# EAGLE design MainBoardR1 (EAGLE 6.4)
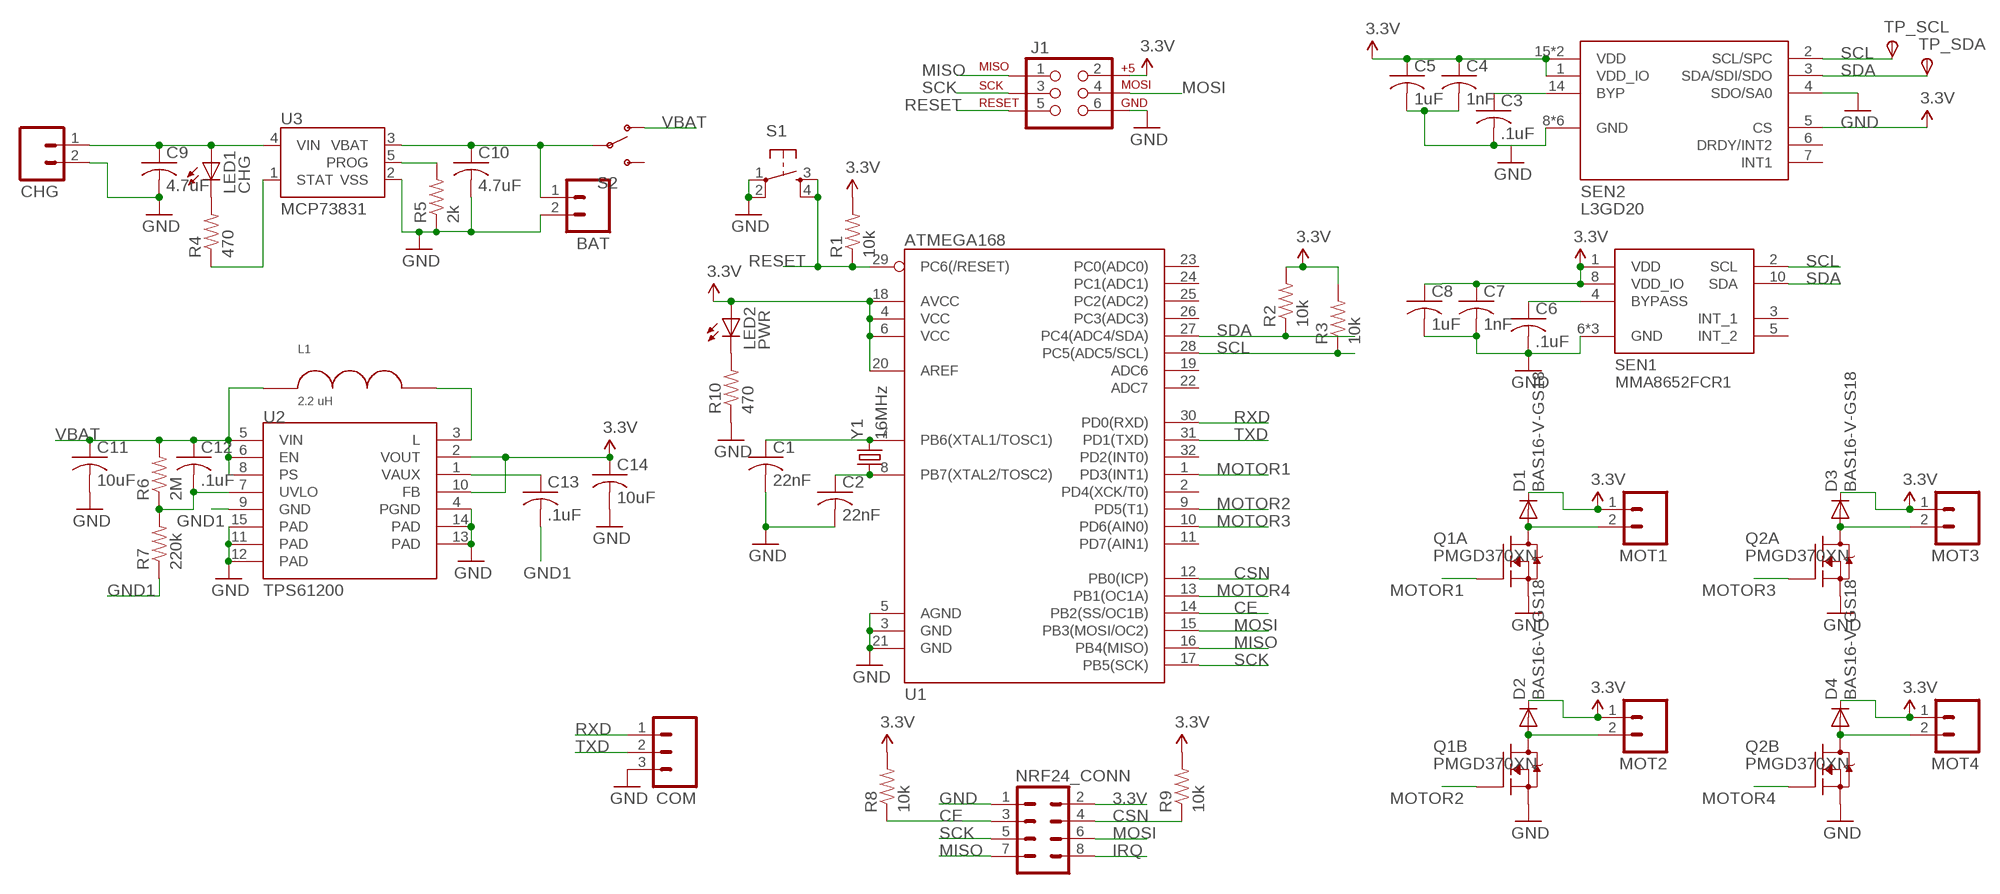
[diagram p0: schematic, sheet 1]

## Parts
BAT  M02LOCK_LONGPADS  [1X02_LOCK_LONGPADS]
C1  22nF  C-USC0805  [C0805]
C2  22nF  C-USC0805  [C0805]
C3  .1uF  C-USC0805  [C0805]
C4  1nF  C-USC0805  [C0805]
C5  1uF  C-USC0805  [C0805]
C6  .1uF  C-USC0805  [C0805]
C7  1nF  C-USC0805  [C0805]
C8  1uF  C-USC0805  [C0805]
C9  4.7uF  C-USC0805  [C0805]
C10  4.7uF  C-USC0805  [C0805]
C11  10uF  C-USC0805  [C0805]
C12  .1uF  C-USC0805  [C0805]
C13  .1uF  C-USC0805  [C0805]
C14  10uF  C-USC0805  [C0805]
CHG  M02LOCK_LONGPADS  [1X02_LOCK_LONGPADS]
COM  M03LONGPADS  [1X03_LONGPADS]
D1  BAS16-V-GS18  [SOT23]
D2  BAS16-V-GS18  [SOT23]
D3  BAS16-V-GS18  [SOT23]
D4  BAS16-V-GS18  [SOT23]
J1  AVR_SPI_PRG_62X3_LOCK  [2X3_LOCK]
L1  2.2 uH  BRHL2518T2R2M  [2518]
LED1  CHG  LED1206  [LED-1206]
LED2  PWR  LED1206  [LED-1206]
MOT1  M02LOCK_LONGPADS  [1X02_LOCK_LONGPADS]
MOT2  M02LOCK_LONGPADS  [1X02_LOCK_LONGPADS]
MOT3  M02LOCK_LONGPADS  [1X02_LOCK_LONGPADS]
MOT4  M02LOCK_LONGPADS  [1X02_LOCK_LONGPADS]
NRF24_CONN  M04X2  [2X4]
Q1  PMGD370XN  [SOT363_INFINEON]
Q2  PMGD370XN  [SOT363_INFINEON]
R1  10k  RESISTOR0805-RES  [0805]
R2  10k  RESISTOR0805-RES  [0805]
R3  10k  RESISTOR0805-RES  [0805]
R4  470  RESISTOR0805-RES  [0805]
R5  2k  RESISTOR0805-RES  [0805]
R6  2M  RESISTOR0805-RES  [0805]
R7  220k  RESISTOR0805-RES  [0805]
R8  10k  RESISTOR0805-RES  [0805]
R9  10k  RESISTOR0805-RES  [0805]
R10  470  RESISTOR0805-RES  [0805]
S1  TAC_SWITCHSMD  [TACTILE_SWITCH_SMD]
S2  SWITCH-SPST-SMD-A  [SWITCH-SPST-SMD-A]
SEN1  MMA8652FCR1  [10_PIN_DFN]
SEN2  L3GD20  [LGA-16]
TP_SCL  TPSTP14SQ  [TP14SQ]
TP_SDA  TPSTP14SQ  [TP14SQ]
U1  ATMEGA168  [TQFP32-08]
U2  TPS61200  [QFN-10_PAD]
U3  MCP73831  [SOT23-5]
Y1  16MHz  CRYSTAL5X3  [CRYSTAL-SMD-5X3]

## Nets
3.3V: C4.1 C5.1 C7.1 C8.1 C14.1 D1.3(C) D2.3(C) D3.3(C) D4.3(C) J1.2 LED2.A MOT1.1 MOT2.1 MOT3.1 MOT4.1 NRF24_CONN.2 R1.2 R2.2 R3.2 R8.2 R9.2 SEN1.1(VDD) SEN1.8(VDD_IO) SEN2.1(VDD_IO) SEN2.5(CS) SEN2.15(VDD) SEN2.16(VDD) U1.4(VCC) U1.6(VCC) U1.18(AVCC) U1.20(AREF) U2.2(VOUT) U2.10(FB)
CE: NRF24_CONN.3 R8.1 U1.14(PB2(SS/OC1B))
CSN: NRF24_CONN.4 R9.1 U1.12(PB0(ICP))
GND: BAT.2 C1.2 C2.2 C3.2 C4.2 C5.2 C6.2 C7.2 C8.2 C9.2 C10.2 C11.2 C14.2 CHG.2 COM.3 J1.6 NRF24_CONN.1 Q1.1(A:S) Q1.4(B:S) Q2.1(A:S) Q2.4(B:S) R5.1 R10.1 S1.1 S1.2 SEN1.6(GND) SEN1.7(GND) SEN1.9(GND) SEN2.4(SDO/SA0) SEN2.8(GND) SEN2.9(GND) SEN2.10(GND) SEN2.11(GND) SEN2.12(GND) SEN2.13(GND) U1.3(GND) U1.5(AGND) U1.21(GND) U2.4(PGND) U2.11(PAD) U2.12(PAD) U2.13(PAD) U2.14(PAD) U2.15(PAD) U3.2(VSS)
GND1: C13.2 R7.1 U2.9(GND)
IRQ: NRF24_CONN.8
MISO: J1.1 NRF24_CONN.7 U1.16(PB4(MISO))
MOSI: J1.4 NRF24_CONN.6 U1.15(PB3(MOSI/OC2))
MOT3: D3.1(A) MOT3.2 Q2.6(A:D)
MOTOR1: Q1.2(A:G) U1.1(PD3(INT1))
MOTOR2: Q1.5(B:G) U1.9(PD5(T1))
MOTOR3: Q2.2(A:G) U1.10(PD6(AIN0))
MOTOR4: Q2.5(B:G) U1.13(PB1(OC1A))
N$1: C3.1 SEN2.14(BYP)
N$2: C1.1 U1.7(PB6(XTAL1/TOSC1)) Y1.3
N$3: C2.1 U1.8(PB7(XTAL2/TOSC2)) Y1.1
N$4: D1.1(A) MOT1.2 Q1.6(A:D)
N$5: LED1.C R4.2
N$6: C6.1 SEN1.4(BYPASS)
N$7: D4.1(A) MOT4.2 Q2.3(B:D)
N$8: D2.1(A) MOT2.2 Q1.3(B:D)
N$9: C9.1 CHG.1 LED1.A U3.4(VIN)
N$10: R4.1 U3.1(STAT)
N$11: BAT.1 C10.1 S2.2(P) U3.3(VBAT)
N$12: R5.2 U3.5(PROG)
N$13: C13.1 U2.1(VAUX)
N$14: C12.2 R6.1 R7.2 U2.7(UVLO)
N$15: LED2.C R10.2
N$16: L1.P$2 U2.3(L)
RESET: J1.5 R1.1 S1.3 S1.4 U1.29(PC6(/RESET))
RXD: COM.1 U1.30(PD0(RXD))
SCK: J1.3 NRF24_CONN.5 U1.17(PB5(SCK))
SCL: R3.1 SEN1.2(SCL) SEN2.2(SCL/SPC) TP_SCL.TP(PP) U1.28(PC5(ADC5/SCL))
SDA: R2.1 SEN1.10(SDA) SEN2.3(SDA/SDI/SDO) TP_SDA.TP(PP) U1.27(PC4(ADC4/SDA))
TXD: COM.2 U1.31(PD1(TXD))
VBAT: C11.1 C12.1 L1.P$1 R6.2 S2.1(O) U2.5(VIN) U2.6(EN) U2.8(PS)
Unconnected: S2.3(S) SEN1.3(INT_1) SEN1.5(INT_2) SEN2.6(DRDY/INT2) SEN2.7(INT1) U1.2(PD4(XCK/T0)) U1.11(PD7(AIN1)) U1.19(ADC6) U1.22(ADC7) U1.23(PC0(ADC0)) U1.24(PC1(ADC1)) U1.25(PC2(ADC2)) U1.26(PC3(ADC3)) U1.32(PD2(INT0))

## Library data of the parts
BAT CHG MOT1-MOT4 = SparkFun:M02: Header 2 Standard 2-pin 0.1" header. Use with straight break away headers (SKU : PRT-00116), right angle break away headers (PRT-00553), swiss pins (PRT-00743), machine pins (PRT-00117), and female headers (PRT-00115). Molex polarized connector foot print use with SKU : PRT-08233 with associated crimp pins and housings.
C1-C14 = rcl:C-US: CAPACITOR, American symbol
COM = SparkFun:M03: Header 3 Standard 3-pin 0.1" header. Use with straight break away headers (SKU : PRT-00116), right angle break away headers (PRT-00553), swiss pins (PRT-00743), machine pins (PRT-00117), and female headers (PRT-00115). Molex polarized connector foot print use with SKU : PRT-08232 with associated crimp pins and housings.
D1-D4 = diode:BAS16-V-GS18
J1 = SparkFun:AVR_SPI_PRG_6: AVR ISP 6 Pin This is the reduced ISP connector for AVR programming. Common on Arduino. This footprint will take up less PCB space and can be used with a 10-pin to 6-pin adapter such as SKU: BOB-08508
L1 = inductors:BRHL2518T2R2M
LED1 LED2 = SparkFun:LED: LEDs Standard schematic elements and footprints for 5mm, 3mm, 1206, and 0603 sized LEDs. 5mm - Spark Fun Electronics SKU : COM-00529 (and others)
NRF24_CONN = SparkFun:M04X2
Q1 Q2 = transistor-fet:PMGD370XN: N-Channel Power MOSFET
R1-R10 = SparkFun:RESISTOR: Resistor Basic schematic elements and footprints for 0603, 1206, and PTH resistors.
S1 = SparkFun:TAC_SWITCH: Momentary Switch Button commonly used for reset or general input. Spark Fun Electronics SKU : COM-00097
S2 = SparkFun:SWITCH-SPST: SPST Switch Simple slide switch. Spark Fun Electronics SKU : COM-00102
SEN1 = Sensors:MMA8652FCR1
SEN2 = Sensors:L3GD20
TP_SCL TP_SDA = testpad:TPS: TEST PIN
U1 = SparkFun:ATMEGA168
U2 = SparkFun:TPS61200: DC to DC Booster
U3 = SparkFun:MCP73831: Microchip's MCP73831 Miniature single cell, fully integrated Li-Ion, Li-polymer charge management controller http://ww1.microchip.com/downloads/en/DeviceDoc/21984a.pdf
Y1 = SparkFun:CRYSTAL: Crystals Various standard crystals. Proven footprints. Spark Fun Electronics SKU : COM-00534

## Board
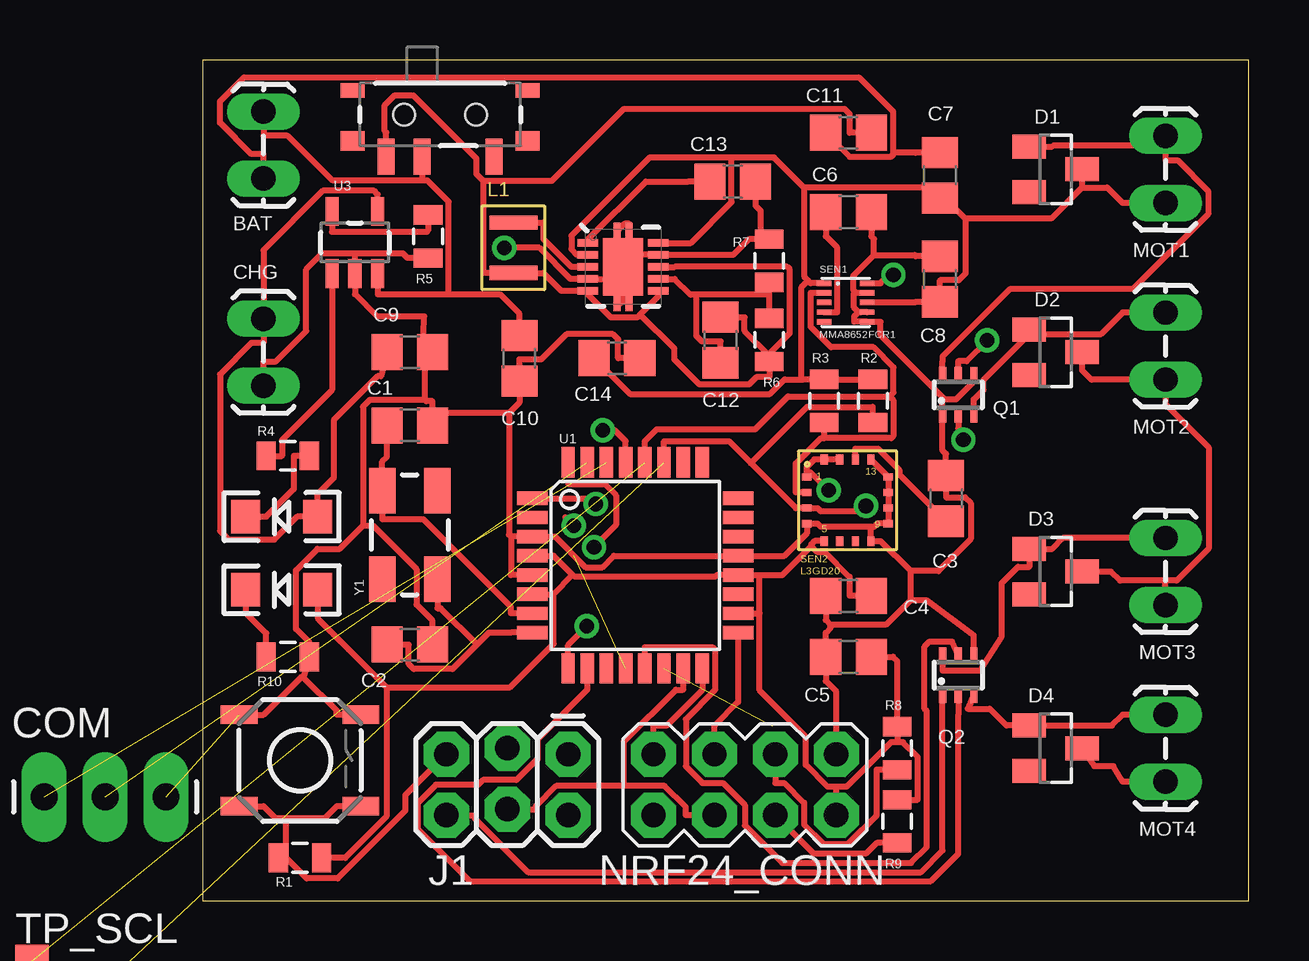
[diagram p1: board, top side]
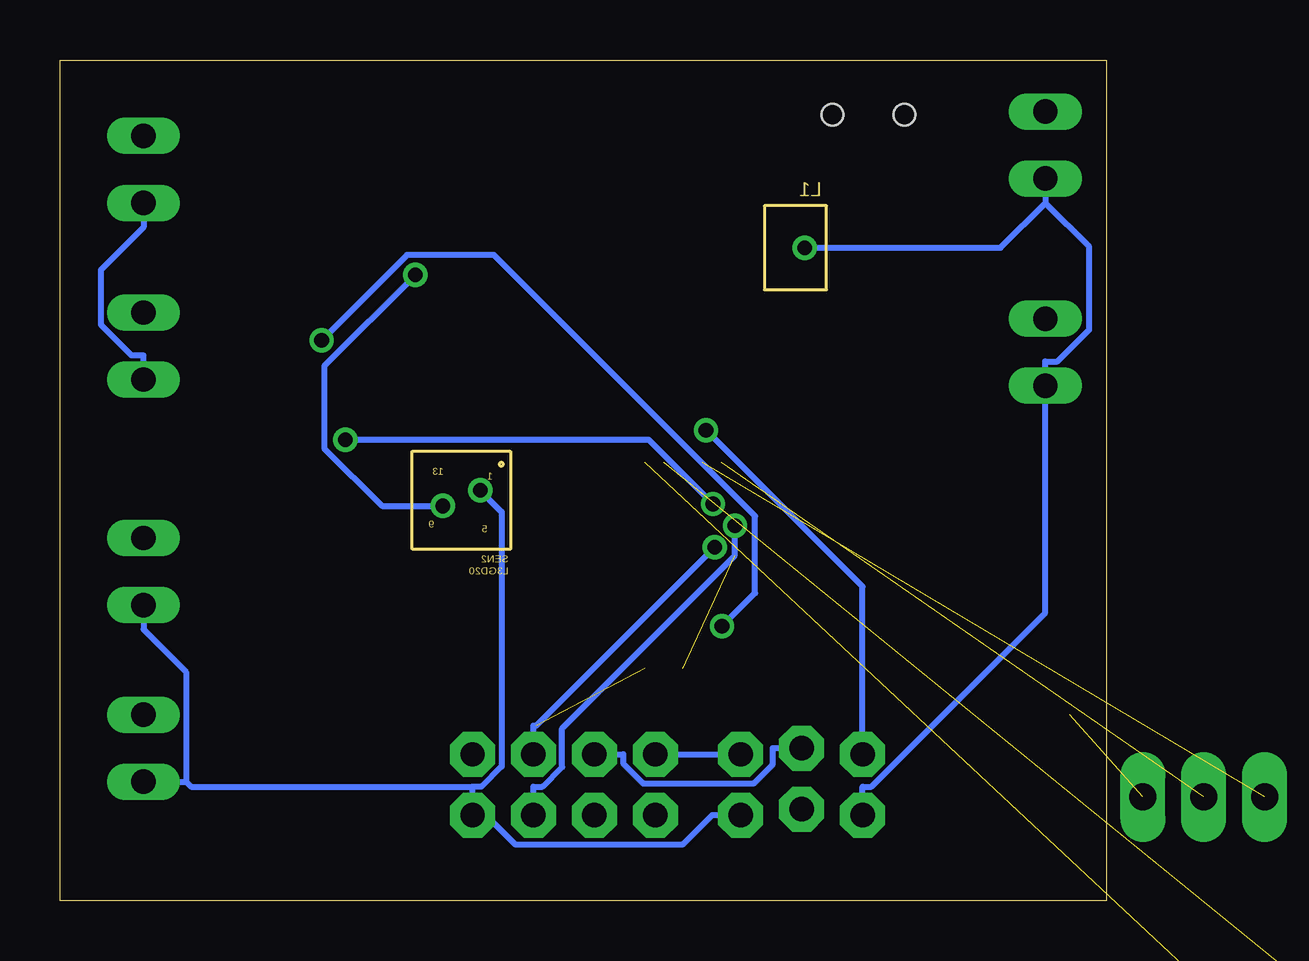
[diagram p2: board, bottom side, seen from below]

Size 43.61 x 35.04 mm. Coordinates in mm from the lower left corner, seen from the top.
Outline: 0,0 43.61,0 43.61,35.04 0,35.04 0,0
Copper layers (1*16): Top 0.035mm / dielectric 1.5mm / Bottom 0.035mm
Design rules "default *": minimum track width 10mil, minimum drill 24mil, track to track 5mil, track to pad 5mil, pad to pad 8mil, via to via 8mil, smd to smd 8mil, copper to edge 40mil, drill to drill 8mil, minimum pad ring 10mil, minimum via ring 8mil, stop-mask expansion 4mil, vias tented up to drill 0mil, thermal gap 10mil

### Footprints (pad centres in the part's own frame; a part is rotated, then mirrored left to right if it is on the bottom)
1X02_LOCK_LONGPADS = drill 1.016 long: 1 -0.127,0; 2 2.667,0
C0805 = smd 1.3 x 1.5: 1 -0.95,0; 2 0.95,0
1X03_LONGPADS = drill 1.118 pad 1.88 long: 1 0,0; 2 2.54,0; 3 5.08,0
SOT23 = smd 1 x 1.4: 1 -0.95,-1.1; 2 0.95,-1.1; 3 0,1.1
2X3_LOCK = drill 1.016 pad 1.88 octagon: 1 0,0; 2 0,2.54; 3 2.54,-0.254; 4 2.54,2.286; 5 5.08,0; 6 5.08,2.54
2518 = smd 0.6 x 2: P$1 0,0; P$2 2.1,0
LED-1206 = smd 1.2 x 1.4: A -1.5,0; C 1.5,0
2X4 = drill 1.016 pad 1.88 octagon: 1 -3.81,-1.27; 2 -3.81,1.27; 3 -1.27,-1.27; 4 -1.27,1.27; 5 1.27,-1.27; 6 1.27,1.27; 7 3.81,-1.27; 8 3.81,1.27
SOT363_INFINEON = smd 0.3 x 0.7: 1 -0.65,-0.8; 2 0,-0.8; 3 0.65,-0.8; 4 0.65,0.8; 5 0,0.8; 6 -0.65,0.8
0805 = smd 0.8 x 1.2: 1 -0.9,0; 2 0.9,0
TACTILE_SWITCH_SMD = smd 1.524 x 0.762: 1 -2.54,1.905; 2 2.54,1.905; 3 -2.54,-1.905; 4 2.54,-1.905
SWITCH-SPST-SMD-A = smd 0.7 x 1.5: 1 -2.25,-1.75; 2 -0.75,-1.75; 3 2.25,-1.75 | smd 1 x 0.6: GND1 -3.65,1; GND3 3.65,1 | smd 1 x 0.8: GND2 -3.65,-1.1; GND4 3.65,-1.1 | hole 0.9: -1.5,0; 1.5,0
10_PIN_DFN = smd 0.6 x 0.225: 1 0,1.6; 2 0,1.2; 3 0,0.8; 4 0,0.4; 5 0,0; 6 1.8,0; 7 1.8,0.4; 8 1.8,0.8; 9 1.8,1.2; 10 1.8,1.6
LGA-16 = smd 0.4 x 0.3: 1 -0.725,2.675; 2 -0.725,2.025; 3 -0.725,1.375; 4 -0.725,0.725; 9 2.675,0.725; 10 2.675,1.375; 11 2.675,2.025; 12 2.675,2.675 | smd 0.3 x 0.4: 5 0,0; 6 0.65,0; 7 1.3,0; 8 1.95,0; 13 1.95,3.4; 14 1.3,3.4; 15 0.65,3.4; 16 0,3.4
TP14SQ = smd 1.4 x 1.4: TP 0,0
TQFP32-08 = smd 1.27 x 0.559: 1 -4.293,2.8; 2 -4.293,2; 3 -4.293,1.2; 4 -4.293,0.4; 5 -4.293,-0.4; 6 -4.293,-1.2; 7 -4.293,-2; 8 -4.293,-2.8; 17 4.293,-2.8; 18 4.293,-2; 19 4.293,-1.2; 20 4.293,-0.4; 21 4.293,0.4; 22 4.293,1.2; 23 4.293,2; 24 4.293,2.8 | smd 0.559 x 1.27: 9 -2.8,-4.293; 10 -2,-4.293; 11 -1.2,-4.293; 12 -0.4,-4.293; 13 0.4,-4.293; 14 1.2,-4.293; 15 2,-4.293; 16 2.8,-4.293; 25 2.8,4.293; 26 2,4.293; 27 1.2,4.293; 28 0.4,4.293; 29 -0.4,4.293; 30 -1.2,4.293; 31 -2,4.293; 32 -2.8,4.293
QFN-10_PAD = smd 0.297 x 0.85: 1 -1,-1.475; 2 -0.5,-1.475; 3 0,-1.475; 4 0.5,-1.475; 5 1,-1.475; 6 1,1.475; 7 0.5,1.475; 8 0,1.475; 9 -0.5,1.475; 10 -1,1.475 | smd 0.7 x 0.28: 11 -1.5,0.25; 12 -1.5,-0.25; 13 1.5,0.25; 14 1.5,-0.25 | smd 2.4 x 1.65: 15 0,0
SOT23-5 = smd 0.55 x 1.2: 1 -0.95,-1.3; 2 0,-1.3; 3 0.95,-1.3; 4 0.95,1.3; 5 -0.95,1.3
CRYSTAL-SMD-5X3 = smd 1.9 x 1.1: 1 -1.85,-1.15; 2 1.85,-1.15; 3 1.85,1.15; 4 -1.85,1.15

### Placement (x,y rotation side)
BAT  2.54,32.77 270 top
C1  8.64,19.81 0 top
C2  8.64,10.67 0 top
C3  30.99,16.76 90 top
C4  26.92,12.7 180 top
C5  26.92,10.16 180 top
C6  26.92,28.7 0 top
C7  30.73,30.23 90 top
C8  30.73,25.91 90 top
C9  8.64,22.86 0 top
C10  13.21,22.61 270 top
C11  26.92,32 180 top
C12  21.59,23.37 270 top
C13  22.1,29.97 0 top
C14  17.27,22.61 0 top
CHG  2.54,24.13 270 top
COM  -6.6,4.32 0 top
D1  35.56,30.48 270 top
D2  35.56,22.86 270 top
D3  35.56,13.72 270 top
D4  35.56,6.35 270 top
J1  15.24,6.1 180 top
L1  12.95,26.16 90 top
LED1  3.3,16 180 top
LED2  3.3,12.95 180 top
MOT1  40.13,29.21 90 top
MOT2  40.13,21.84 90 top
MOT3  40.13,12.45 90 top
MOT4  40.13,5.08 90 top
NRF24_CONN  22.61,4.83 180 top
Q1  31.5,21.08 0 top
Q2  31.5,9.4 0 top
R1  4.06,1.78 0 top
R2  27.94,20.83 90 top
R3  25.91,20.83 90 top
R4  3.56,18.54 0 top
R5  9.4,27.69 90 top
R6  23.62,23.37 270 top
R7  23.62,26.67 270 top
R8  28.96,6.35 90 top
R9  28.96,3.3 90 top
R10  3.56,10.16 180 top
S1  4.06,5.84 0 top
S2  9.91,32.77 0 top
SEN1  25.91,24.13 0 top
SEN2  25.91,14.99 0 top
TP_SCL  -7.11,-2.54 0 top  (outside the outline)
TP_SDA  -7.11,-6.35 0 top  (outside the outline)
U1  18.03,13.97 0 top
U2  17.53,26.42 270 top
U3  6.35,27.43 0 top
Y1  8.64,15.24 90 top

### Tracks (layer width: path | path; a pad name or v marks a point on that pad's centre or on a via)
3.3V  (via drill 0.61 pad 1.02)
  Top 0.254: 31.8,28.44 31.8,26.14 31.52,25.86 30.73,25.86 C8.1 29.73,24.96 29.7,24.93 SEN1.8 | 30.73,29.5 31.8,28.44 | 36.66,29.73 35.37,28.44 31.8,28.44 | 36.66,29.73 36.66,29.91 D1.3 | 30.73,29.5 30.73,29.73 25.07,29.73 | C7.1 30.73,29.5 | 15.43,13.57 15.49,13.52 21.38,13.52 21.44,13.57 U1.20 23.12,13.57 23.22,13.57 | D4.3 37.17,5.6 37.97,5.6 38.35,4.95 MOT4.1 | R2.2 R3.2 25.48,21.73 25.05,21.73 24.96,21.73 | C14.1 17.81,21.12 23.65,21.12 24.26,21.73 24.96,21.73 | 24.96,21.73 24.96,25.58 25.23,25.85 | 25.37,14.77 25.61,14.53 25.93,14.53 26.97,13.5 26.97,12.7 C4.1 | 25.37,14.77 25.37,14.85 25.5,14.99 SEN2.5 | 23.22,13.57 24.17,13.57 25.37,14.77 | 23.22,11.97 23.22,13.57 | 26.42,4.75 26.05,4.75 25.15,5.65 25.15,6.83 23.22,8.76 23.22,11.97 | 25.23,25.85 25.35,25.73 SEN1.1 | 25.07,29.73 25.07,26.01 25.23,25.85 | 25.07,29.73 | 25.07,29.73 23.82,30.98 22.05,30.98 | 15.43,13.57 14.63,12.77 | 15.43,13.57 14.63,14.37 U1.4 | 7.67,8.89 12.82,8.89 14.63,10.71 14.63,12.77 | LED2.A 4.8,11.76 7.67,8.89 | 7.67,8.89 7.67,3.5 5.95,1.78 R1.2 | MOT1.1 38.35,29.08 37.71,29.73 36.66,29.73 | SEN2.15 SEN2.16 25.5,18.39 25.18,18.07 25.18,17.86 | U1.6 14.63,12.77 | 22.05,30.98 18.63,30.98 15.37,27.72 15.37,27.16 15.62,26.92 U2.2 | U1.18 23.22,11.97 | NRF24_CONN.2 26.42,4.75 | 28.96,6.6 28.69,6.6 26.85,4.75 26.42,4.75 | 28.96,6.6 29.2,6.6 29.81,5.99 29.81,4.2 R9.2 | U2.10 20.35,27.42 22.05,29.12 22.05,30.98 | 40.13,13.34 40.6,13.34 41.94,14.67 41.94,18.89 40.13,20.7 MOT2.1 37.05,21.72 36.66,22.11 D2.3 | 28.96,6.6 R8.2 28.96,7.9 28.96,9.98 28.78,10.16 C5.1 | MOT3.1 40.13,12.83 40.13,13.34 | D3.3 37.87,13.72 38.25,13.34 40.13,13.34
  Top 0.254: 25.18,17.86 25.33,17.86 v26.1,17.1 | SEN2.1 25.18,17.86
  Bottom 0.254: MOT2.1 40.13,22.73 40.64,22.73 41.91,24 41.91,26.29 40.13,28.07 MOT1.1 | MOT3.1 40.13,11.3 38.35,9.53 38.35,4.95 | J1.2 16.43,3.56 17.65,2.34 24.64,2.34 26.42,4.12 | 26.42,4.12 26.42,4.75 | NRF24_CONN.2 26.42,4.12 | MOT4.1 38.35,4.95 | 38.35,4.95 38.15,4.75 26.42,4.75 | v26.1,17.1 25.2,16.21 25.2,5.59 26.05,4.75 26.42,4.75
CE  (via drill 0.61 pad 1.02)  (1 unrouted)
  Top 0.254: 15.23,17.37 16.76,17.37 17.23,16.91 17.23,15.65 v16.32,14.73 | R8.1 28.1,5.45 28.1,3.55 26.91,2.36 25.87,2.36 25.07,3.16 25.07,4.08 24.25,4.9 23.88,4.9 NRF24_CONN.3
  Bottom 0.254: v16.32,14.73 23.76,7.29 23.88,7.29 NRF24_CONN.3
CSN  (via drill 0.61 pad 1.02)  (1 unrouted)
  Top 0.254: 15.12,15.97 v15.48,15.62 | R9.1 28.1,2.4 27.68,1.98 25.46,1.98 NRF24_CONN.4
  Bottom 0.254: v15.48,15.62 15.48,14.39 22.68,7.18 22.68,5.57 23.5,4.75 23.88,4.75 NRF24_CONN.4
GND  (via drill 0.61 pad 1.02)  (1 unrouted)
  Top 0.254: 12.85,15.17 12.85,13.57 U1.5 | 12.77,20.31 12.77,15.25 12.85,15.17 | 12.77,20.31 9.59,20.31 | 12.77,20.31 13.21,20.75 C10.2 13.21,22.56 14.11,22.56 15.16,23.61 17.11,23.61 17.32,23.4 17.32,22.61 C14.2 | 12.85,15.17 U1.3 14.7,15.17 15.97,13.9 16.66,13.9 17.14,14.37 U1.21 24.25,14.37 25.18,15.31 SEN2.4 25.64,15.71 25.77,15.58 27.86,15.58 | 27.86,15.58 27.99,15.58 28.13,15.71 SEN2.9 SEN2.10 SEN2.11 SEN2.12 SEN2.13 | 27.86,15.58 27.86,15.44 SEN2.8 28.26,14.99 29.52,13.73 | 6.68,15.63 7.1,15.63 8.92,13.82 8.92,12.34 9.59,11.67 C2.2 | 9.27,20.88 6.97,20.88 6.68,20.59 6.68,15.63 | 6.68,15.63 5.72,14.67 4.79,14.67 3.89,13.77 3.89,11.32 4.46,10.76 R10.1 4.2,9.31 | 9.27,20.88 9.27,22.86 | 9.27,20.88 9.33,20.82 9.59,20.82 9.59,20.31 | C1.2 9.59,20.31 | BAT.2 2.54,31.11 2.03,31.11 0.73,32.42 0.73,33.32 1.73,34.32 27.36,34.32 28.78,32.9 28.78,31.18 | 28.78,31.18 28.78,31.09 28.69,31 26.98,31 C11.2 | 28.78,31.18 29.73,31.18 C7.2 | C8.2 29.73,26.86 29.67,26.92 27.99,26.92 | 30.95,20.89 28.26,23.58 28.26,24.13 SEN1.6 27.15,24.13 27.15,24.35 27.34,24.53 | Q1.4 32.15,21.63 31.4,20.89 30.95,20.89 | 30.95,20.89 30.85,20.89 Q1.1 30.85,18.76 30.99,18.62 C3.2 30.99,16.81 31.78,16.81 32.02,16.57 32.02,15.08 30.67,13.73 29.52,13.73 | 30.95,20.89 | Q2.1 30.85,2.09 29.95,1.19 13.57,1.19 11.35,3.41 11.35,3.56 J1.6 | 29.52,12.53 28.48,11.49 26.18,11.49 | Q2.4 32.15,11.06 30.17,12.53 29.52,12.53 | 17.53,25 17.69,25 U2.13 | U2.14 17.44,24.92 17.53,25 | 17.53,25 17.53,25.08 17.53,25.95 | 9.27,22.86 9.2,22.86 9.24,24.35 7.28,24.35 6.35,25.28 U3.2 6.35,26.99 | C9.2 9.27,22.86 | 29.52,12.53 29.52,13.73
  Top 0.254: 26.18,11.49 25.97,11.7 C4.2 | 26.18,11.49 26.18,11.37 25.97,11.16 C5.2 25.97,9.16 26.42,8.71 NRF24_CONN.1 | 27.99,26.92 27.99,27.58 27.87,27.7 C6.2 | 27.25,25.33 27.12,25.45 27.12,26.05 27.99,26.92 | 27.25,25.33 27.15,25.33 27.15,24.71 27.34,24.53 | 27.25,25.33 27.34,25.33 27.43,25.33 SEN1.9 | 27.34,24.53 27.43,24.53 SEN1.7 | v12.57,27.21 14.04,27.21 15.33,25.92 U2.4 16.3,25.92 16.73,25.92 16.76,25.95 17.53,25.95 | CHG.2 2.54,22.48 3.05,22.48 4.32,23.75 4.32,26.32 4.98,26.99 6.35,26.99 | R5.1 8.54,26.79 8.34,26.99 6.35,26.99 | 17.53,25.95 U2.15 17.53,27.06 17.28,27.31 U2.12 17.58,28.22 17.78,28.22 U2.11 | S1.2 5.59,7.75 5.59,7.92 4.2,9.31 | S1.1 2.54,7.75 4.1,9.31 4.2,9.31
  Bottom 0.254: v12.57,27.21 4.41,27.21 2.54,29.08 | J1.6 10.16,4.75 9.79,4.75 2.54,12 CHG.2 2.54,22.48 2.03,22.48 0.72,23.8 0.72,27.26 2.54,29.08 | BAT.2 2.54,29.08
GND1
  Top 0.254: C13.2 23.05,28.97 23.26,28.76 23.26,27.57 | 23.26,27.57 22.77,27.57 22.11,26.92 U2.9 | R7.1 23.26,27.57
MISO
  Top 0.254: NRF24_CONN.7 18.8,7.29 19.34,7.29 20.83,8.79 U1.16
  Bottom 0.254: NRF24_CONN.7 J1.1
MOSI
  Top 0.254: 17.57,4.78 14.74,4.78 13.89,3.93 13.89,3.81 J1.4 | 17.57,4.78 19.26,4.78 20.14,3.9 20.14,3.56 NRF24_CONN.6 | 17.57,4.78 17.57,6.63 19.73,8.79 20.03,8.79 U1.15
MOT3
  Top 0.254: Q2.6 30.85,9.59 32.42,9.59 33.31,10.99 33.31,13.24 33.99,13.91 34.46,13.91 D3.1 35.41,14.67 35.86,15.11 MOT3.2
MOTOR1  (via drill 0.61 pad 1.02)
  Top 0.254: v31.71,19.21 31.71,19.46 31.5,19.68 Q1.2 | U1.1 16.16,16.77 v16.39,16.53
  Bottom 0.254: v31.71,19.21 19.08,19.21 v16.39,16.53
MOTOR2  (via drill 0.61 pad 1.02)
  Top 0.254: v32.71,23.35 31.84,22.49 31.5,22.49 Q1.5 | U1.9 15.23,10.66 v16.02,11.44
  Bottom 0.254: v16.02,11.44 14.64,12.82 14.64,16.03 25.53,26.92 29.14,26.92 v32.71,23.35
MOTOR3
  Top 0.254: Q2.2 31.5,7.74 31.5,1.94 30.36,0.81 11.15,0.81 8.96,2.99 8.96,4.06 9.73,4.83 11.49,4.83 11.69,5.02 13.09,5.02 13.97,5.91 13.97,6.72 16.03,8.79 U1.10
MOTOR4
  Top 0.254: Q2.5 31.24,10.8 30.3,10.8 30.09,10.59 30.09,8 30.19,7.9 30.19,2.23 29.53,1.57 24.16,1.57 22.61,3.13 22.61,3.98 21.68,4.9 20.84,4.9 20.14,5.6 20.14,7.56 21.37,8.78 21.37,10.45 21.25,10.57 18.43,10.57 U1.13
N$1
  Top 0.254: SEN2.14 27.21,18.84 28.16,18.84 29.04,17.96 29.04,17.77 C3.1
N$2
  Top 0.254: U1.7 12.85,11.97 12.85,12.24 9.21,15.89 7.49,15.89 Y1.3 7.49,18.29 7.69,18.49 C1.1
N$3
  Top 0.254: 11.44,10.67 10.41,9.65 8.8,9.65 8.59,9.86 8.59,10.67 C2.1 | 11.44,10.67 11.93,11.16 12.84,11.16 12.85,11.17 U1.8 | 11.44,10.67 9.93,12.19 9.79,12.19 Y1.1
N$4
  Top 0.254: D1.1 35.41,31.43 35.44,31.46 40.13,31.46 | 40.13,31.46 40.13,30.86 40.64,30.86 41.92,29.58 41.92,28.61 38.78,25.48 33.65,25.48 30.85,22.68 30.85,22.49 Q1.6 | MOT1.2 40.13,31.46
N$5
  Top 0.254: LED1.C 2.66,16 3.8,17.15 3.8,18.54 R4.2
N$6
  Top 0.254: C6.1 25.97,27.7 26.46,27.21 26.46,24.53 SEN1.4
N$7
  Top 0.254: Q2.3 31.89,7.99 32.81,7.99 33.51,7.3 D4.1 37.91,7.3 38.35,7.75 MOT4.2
N$8
  Top 0.254: Q1.3 32.15,20.89 32.55,21.29 32.55,21.71 34.46,23.62 | MOT2.2 38.35,24.51 37.46,23.62 34.46,23.62 | D2.1 34.46,23.62
N$9
  Top 0.254: U3.4 7.3,29.43 7.14,29.59 5.01,29.59 2.54,27.11 CHG.1 2.54,23.24 2.03,23.24 0.73,21.94 0.73,15.41 1.09,15.05 2.99,15.05 3.95,16 LED1.A 4.8,16.96 5.47,17.62 5.47,20.02 7.3,21.86 7.43,21.86 C9.1
N$10
  Top 0.254: R4.1 3.31,18.54 3.31,19.2 5.4,21.29 U3.1
N$11
  Top 0.254: 10.26,25.28 12.39,25.28 13.21,24.46 C10.1 | 10.26,25.28 7.3,25.28 U3.3 | 10.26,25.28 10.26,29.13 9.37,30.01 9.16,30.01 | BAT.1 2.54,31.88 3.56,31.88 5.42,30.01 9.16,30.01 | S2.2 9.16,30.01
N$12
  Top 0.254: R5.2 9.4,27.93 9.34,27.88 5.4,27.88 U3.5
N$13
  Top 0.254: U2.1 16.05,27.55 18.48,29.97 20.24,29.97 C13.1
N$14
  Top 0.254: C12.2 21.59,23.32 20.8,23.32 20.57,23.55 20.57,25.26 | 20.57,25.26 20.34,25.26 19.68,25.92 U2.7 | 23.62,25.26 20.57,25.26 | 23.62,25.26 R7.2 | R6.1 23.62,25.26
N$15
  Top 0.254: LED2.C 1.8,12 2.66,11.15 R10.2
N$16
  Top 0.254: L1.P$2 14.21,28.26 14.21,27.58 15.37,26.42 U2.3
N$17
  Top 0.254: 19.05,26.92 18.03,26.92
RESET  (via drill 0.61 pad 1.02)
  Top 0.254: U1.29 17.63,19.15 17.18,19.61 v16.68,19.61 | J1.5 8.45,4.39 8.45,3.74 5.63,0.92 4.35,0.92 3.49,1.78 | S1.4 5.59,3.94 5.08,3.43 3.49,3.43 | 3.49,3.43 3.05,3.43 2.54,3.94 S1.3 | 3.49,1.78 3.49,3.43 | R1.1 3.49,1.78
  Bottom 0.254: J1.5 10.16,13.09 v16.68,19.61
RXD  (1 unrouted)
SCK
  Top 0.254: NRF24_CONN.5 21.34,7.29 22.33,8.28 U1.17
  Bottom 0.254: J1.3 13.89,6.35 13.89,5.68 14.69,4.88 19.3,4.88 20.14,5.72 20.14,6.1 NRF24_CONN.5
SCL  (1 unrouted)
  Top 0.254: SEN2.2 24.73,17.01 24.73,18.22 25.78,19.27 25.91,19.27 | 28.63,21.02 28.8,21.19 28.8,22.23 27.96,23.07 26.2,23.07 25.35,23.91 25.35,25.33 SEN1.2 | 28.63,21.02 24.41,21.02 23.04,19.65 18.93,19.65 18.43,19.15 U1.28 | 28.63,21.02 28.79,20.86 28.79,19.36 28.71,19.27 25.91,19.27 | R3.1 25.91,19.27
SDA  (via drill 0.61 pad 1.02)  (1 unrouted)
  Top 0.254: v27.65,16.45 27.44,16.24 25.76,16.24 25.64,16.36 25.41,16.36 SEN2.3 24.73,16.36 22.86,18.23 | 22.86,18.23 21.94,19.15 19.23,19.15 U1.27 | 22.86,18.23 25.2,20.58 27.94,20.58 R2.1 | v28.8,26.08 28.61,26.08 28.26,25.73 SEN1.10
  Bottom 0.254: v28.8,26.08 32.59,22.28 32.59,18.85 30.19,16.45 v27.65,16.45
TXD  (1 unrouted)
VBAT
  Top 0.254: 18.24,24.44 19.67,23.01 19.67,22.56 20.71,21.51 22.78,21.51 23.08,21.81 23.62,21.81 R6.2 23.62,22.63 23.62,22.71 | 18.24,24.44 18.12,24.31 17.02,24.31 16.05,25.28 U2.5 14.95,25.42 14.21,26.16 L1.P$1 11.7,26.16 11.7,30 | U2.6 19,25.19 18.24,24.44 | C11.1 26.97,32 26.97,32.8 26.76,33.01 17.57,33.01 14.56,30 11.7,30 | C12.1 22.59,24.32 22.59,23.74 23.62,22.71 | 23.62,22.71 23.62,22.8 24.48,23.65 24.48,26.32 24.37,26.42 19.69,26.42 19.68,26.42 U2.8 | 11.7,30 11.41,30.29 11.41,30.94 8.78,33.57 8.01,33.57 7.59,33.16 7.59,32.08 7.66,32.02 S2.1